# Altium schematic sheet TelemetryClick.SchDoc
size A
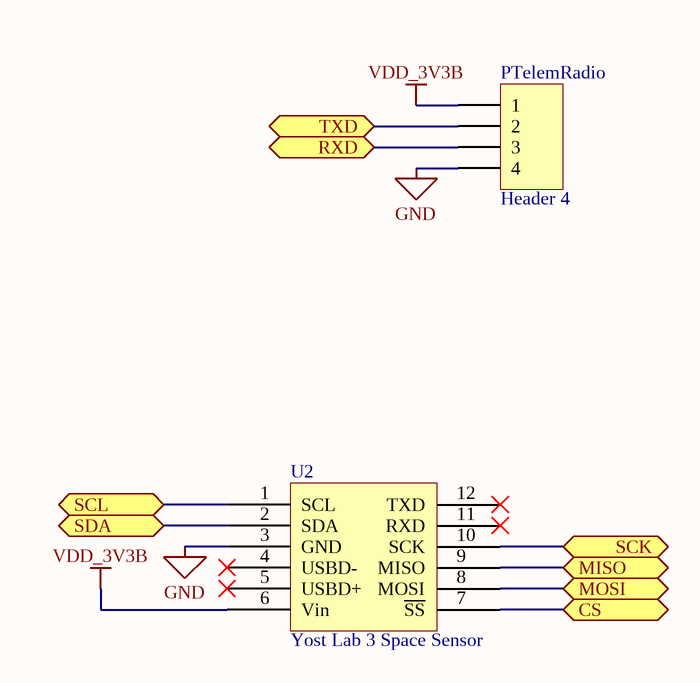
[diagram p0: TelemetryClick.SchDoc]

## Parts
PTelemRadio  Header 4  [HDR1X4]
U2  Yost Lab 3 Space Sensor  [Yost 3 Space Sensor]

## Ports
CS, MISO, MOSI, RXD, SCK, SCL, SDA, TXD

## Nets
GND: PTelemRadio.4 U2.3(GND)
VDD_3V3B: PTelemRadio.1 U2.6(Vin)
CS: U2.7(~{SS}) ; port CS
MISO: U2.9(MISO) ; port MISO
MOSI: U2.8(MOSI) ; port MOSI
RXD: PTelemRadio.3 ; port RXD
SCK: U2.10(SCK) ; port SCK
SCL: U2.1(SCL) ; port SCL
SDA: U2.2(SDA) ; port SDA
TXD: PTelemRadio.2 ; port TXD

Not connected (* = marked no-connect by the designer): U2 4(USBD-)* 5(USBD+)* 11(RXD)* 12(TXD)*

## Library data of the parts
PTelemRadio = Header 4: Header, 4-Pin; LatestRevisionDate: 17-Jul-2002; LatestRevisionNote: Re-released for DXP Platform.; Publisher: Altium Limited
U2 = Yost Lab 3 Space Sensor: Manufacturer Part Number: Yost Lab 3 Space Sensor